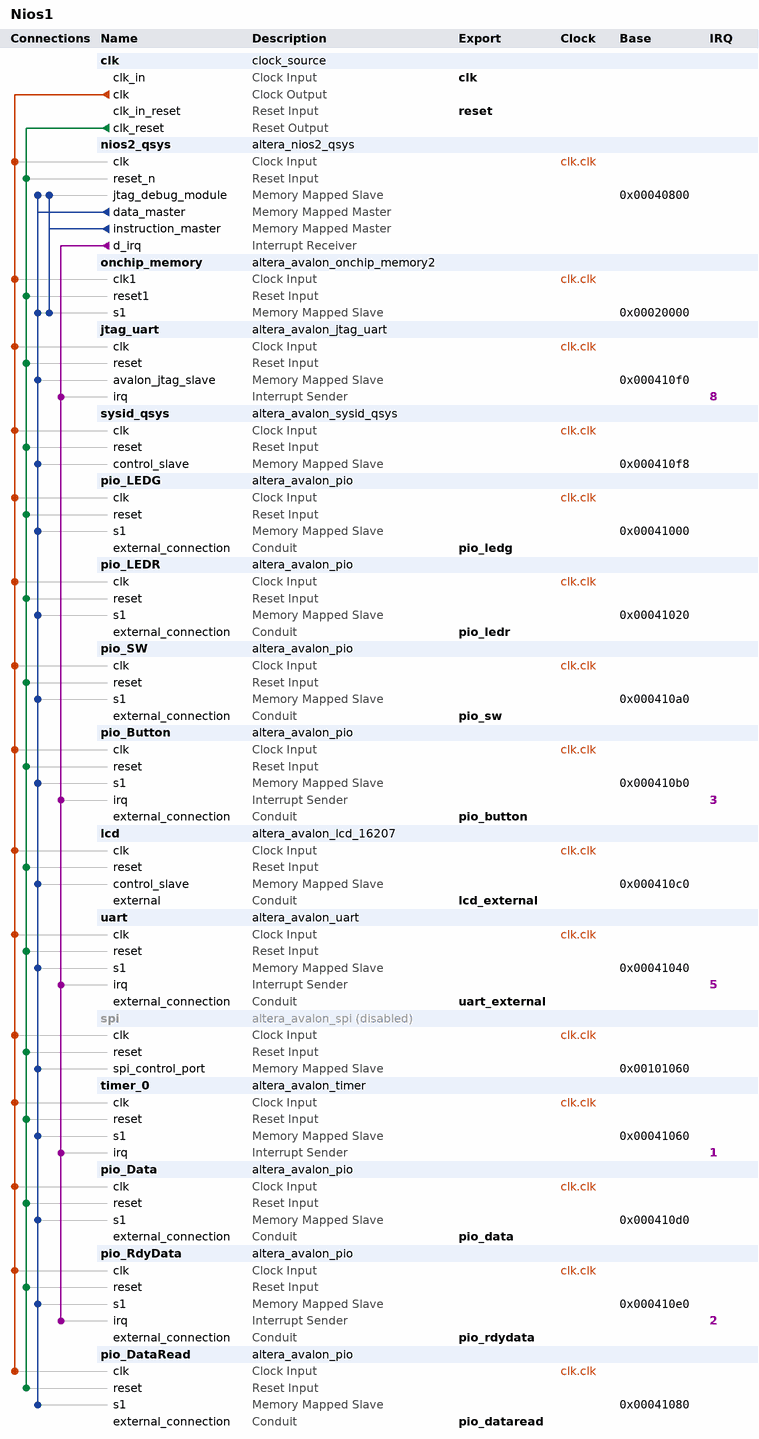
[diagram p0: system contents]
# Platform Designer (Qsys) system Nios1
# Parameters at their usual value, and those the tool derives, are not listed.
package require -exact qsys 11.1
create_system Nios1
set_project_property DEVICE_FAMILY CYCLONEIVE

add_instance clk clock_source 11.1
set_instance_parameter_value clk clockFrequency 50000000

add_instance nios2_qsys altera_nios2_qsys 11.1
set_instance_parameter_value nios2_qsys resetSlave onchip_memory.s1
set_instance_parameter_value nios2_qsys exceptionSlave onchip_memory.s1
set_instance_parameter_value nios2_qsys breakSlave nios2_qsys.jtag_debug_module
set_instance_parameter_value nios2_qsys impl Fast
set_instance_parameter_value nios2_qsys icache_size 4096

add_instance onchip_memory altera_avalon_onchip_memory2 11.1
set_instance_parameter_value onchip_memory dataWidth 32
set_instance_parameter_value onchip_memory dualPort false
set_instance_parameter_value onchip_memory initMemContent true
set_instance_parameter_value onchip_memory initializationFileName onchip_memory
set_instance_parameter_value onchip_memory memorySize 128000

add_instance jtag_uart altera_avalon_jtag_uart 11.1
set_instance_parameter_value jtag_uart simInteractiveOptions INTERACTIVE_ASCII_OUTPUT

add_instance sysid_qsys altera_avalon_sysid_qsys 11.1
set_instance_parameter_value sysid_qsys id 0

add_instance pio_LEDG altera_avalon_pio 11.1
set_instance_parameter_value pio_LEDG bitModifyingOutReg true
set_instance_parameter_value pio_LEDG direction Output
set_instance_parameter_value pio_LEDG width 8

add_instance pio_LEDR altera_avalon_pio 11.1
set_instance_parameter_value pio_LEDR bitModifyingOutReg true
set_instance_parameter_value pio_LEDR direction Output
set_instance_parameter_value pio_LEDR width 18

add_instance pio_SW altera_avalon_pio 11.1
set_instance_parameter_value pio_SW direction Input
set_instance_parameter_value pio_SW width 18

add_instance pio_Button altera_avalon_pio 11.1
set_instance_parameter_value pio_Button captureEdge true
set_instance_parameter_value pio_Button direction Input
set_instance_parameter_value pio_Button edgeType FALLING
set_instance_parameter_value pio_Button generateIRQ true
set_instance_parameter_value pio_Button irqType EDGE
set_instance_parameter_value pio_Button width 3

add_instance lcd altera_avalon_lcd_16207 11.1

add_instance uart altera_avalon_uart 11.1
set_instance_parameter_value uart baud 115200
set_instance_parameter_value uart dataBits 8
set_instance_parameter_value uart fixedBaud true
set_instance_parameter_value uart parity NONE
set_instance_parameter_value uart stopBits 1

add_instance spi altera_avalon_spi 11.1
set_instance_property spi ENABLED false
set_instance_parameter_value spi clockPolarity 0
set_instance_parameter_value spi dataWidth 8
set_instance_parameter_value spi masterSPI true
set_instance_parameter_value spi numberOfSlaves 1
set_instance_parameter_value spi targetClockRate 128000

add_instance timer_0 altera_avalon_timer 11.1
set_instance_parameter_value timer_0 period 1
set_instance_parameter_value timer_0 periodUnits MSEC
set_instance_parameter_value timer_0 timerPreset CUSTOM

add_instance pio_Data altera_avalon_pio 11.1
set_instance_parameter_value pio_Data direction Input
set_instance_parameter_value pio_Data width 12

add_instance pio_RdyData altera_avalon_pio 11.1
set_instance_parameter_value pio_RdyData captureEdge true
set_instance_parameter_value pio_RdyData direction Input
set_instance_parameter_value pio_RdyData generateIRQ true
set_instance_parameter_value pio_RdyData irqType EDGE
set_instance_parameter_value pio_RdyData width 1

add_instance pio_DataRead altera_avalon_pio 11.1
set_instance_parameter_value pio_DataRead bitModifyingOutReg true
set_instance_parameter_value pio_DataRead direction Output
set_instance_parameter_value pio_DataRead width 2

# connections
add_connection clk.clk jtag_uart.clk clock
add_connection clk.clk lcd.clk clock
add_connection clk.clk nios2_qsys.clk clock
add_connection clk.clk onchip_memory.clk1 clock
add_connection clk.clk pio_Button.clk clock
add_connection clk.clk pio_Data.clk clock
add_connection clk.clk pio_DataRead.clk clock
add_connection clk.clk pio_LEDG.clk clock
add_connection clk.clk pio_LEDR.clk clock
add_connection clk.clk pio_RdyData.clk clock
add_connection clk.clk pio_SW.clk clock
add_connection clk.clk spi.clk clock
add_connection clk.clk sysid_qsys.clk clock
add_connection clk.clk timer_0.clk clock
add_connection clk.clk uart.clk clock
add_connection clk.clk_reset jtag_uart.reset reset
add_connection clk.clk_reset lcd.reset reset
add_connection clk.clk_reset nios2_qsys.reset_n reset
add_connection clk.clk_reset onchip_memory.reset1 reset
add_connection clk.clk_reset pio_Button.reset reset
add_connection clk.clk_reset pio_Data.reset reset
add_connection clk.clk_reset pio_DataRead.reset reset
add_connection clk.clk_reset pio_LEDG.reset reset
add_connection clk.clk_reset pio_LEDR.reset reset
add_connection clk.clk_reset pio_RdyData.reset reset
add_connection clk.clk_reset pio_SW.reset reset
add_connection clk.clk_reset spi.reset reset
add_connection clk.clk_reset sysid_qsys.reset reset
add_connection clk.clk_reset timer_0.reset reset
add_connection clk.clk_reset uart.reset reset
add_connection nios2_qsys.data_master jtag_uart.avalon_jtag_slave avalon
set_connection_parameter_value nios2_qsys.data_master/jtag_uart.avalon_jtag_slave baseAddress 0x000410f0
add_connection nios2_qsys.data_master lcd.control_slave avalon
set_connection_parameter_value nios2_qsys.data_master/lcd.control_slave baseAddress 0x000410c0
add_connection nios2_qsys.data_master nios2_qsys.jtag_debug_module avalon
set_connection_parameter_value nios2_qsys.data_master/nios2_qsys.jtag_debug_module baseAddress 0x00040800
add_connection nios2_qsys.data_master onchip_memory.s1 avalon
set_connection_parameter_value nios2_qsys.data_master/onchip_memory.s1 baseAddress 0x00020000
add_connection nios2_qsys.data_master pio_Button.s1 avalon
set_connection_parameter_value nios2_qsys.data_master/pio_Button.s1 baseAddress 0x000410b0
add_connection nios2_qsys.data_master pio_Data.s1 avalon
set_connection_parameter_value nios2_qsys.data_master/pio_Data.s1 baseAddress 0x000410d0
add_connection nios2_qsys.data_master pio_DataRead.s1 avalon
set_connection_parameter_value nios2_qsys.data_master/pio_DataRead.s1 baseAddress 0x00041080
add_connection nios2_qsys.data_master pio_LEDG.s1 avalon
set_connection_parameter_value nios2_qsys.data_master/pio_LEDG.s1 baseAddress 0x00041000
add_connection nios2_qsys.data_master pio_LEDR.s1 avalon
set_connection_parameter_value nios2_qsys.data_master/pio_LEDR.s1 baseAddress 0x00041020
add_connection nios2_qsys.data_master pio_RdyData.s1 avalon
set_connection_parameter_value nios2_qsys.data_master/pio_RdyData.s1 baseAddress 0x000410e0
add_connection nios2_qsys.data_master pio_SW.s1 avalon
set_connection_parameter_value nios2_qsys.data_master/pio_SW.s1 baseAddress 0x000410a0
add_connection nios2_qsys.data_master spi.spi_control_port avalon
set_connection_parameter_value nios2_qsys.data_master/spi.spi_control_port baseAddress 0x00101060
add_connection nios2_qsys.data_master sysid_qsys.control_slave avalon
set_connection_parameter_value nios2_qsys.data_master/sysid_qsys.control_slave baseAddress 0x000410f8
add_connection nios2_qsys.data_master timer_0.s1 avalon
set_connection_parameter_value nios2_qsys.data_master/timer_0.s1 baseAddress 0x00041060
add_connection nios2_qsys.data_master uart.s1 avalon
set_connection_parameter_value nios2_qsys.data_master/uart.s1 baseAddress 0x00041040
add_connection nios2_qsys.instruction_master nios2_qsys.jtag_debug_module avalon
set_connection_parameter_value nios2_qsys.instruction_master/nios2_qsys.jtag_debug_module baseAddress 0x00040800
add_connection nios2_qsys.instruction_master onchip_memory.s1 avalon
set_connection_parameter_value nios2_qsys.instruction_master/onchip_memory.s1 baseAddress 0x00020000
add_connection nios2_qsys.d_irq jtag_uart.irq interrupt
set_connection_parameter_value nios2_qsys.d_irq/jtag_uart.irq irqNumber 8
add_connection nios2_qsys.d_irq pio_Button.irq interrupt
set_connection_parameter_value nios2_qsys.d_irq/pio_Button.irq irqNumber 3
add_connection nios2_qsys.d_irq pio_RdyData.irq interrupt
set_connection_parameter_value nios2_qsys.d_irq/pio_RdyData.irq irqNumber 2
add_connection nios2_qsys.d_irq timer_0.irq interrupt
set_connection_parameter_value nios2_qsys.d_irq/timer_0.irq irqNumber 1
add_connection nios2_qsys.d_irq uart.irq interrupt
set_connection_parameter_value nios2_qsys.d_irq/uart.irq irqNumber 5

# exported interfaces
add_interface clk clock sink
set_interface_property clk EXPORT_OF clk.clk_in
add_interface reset reset sink
set_interface_property reset EXPORT_OF clk.clk_in_reset
add_interface pio_ledg conduit end
set_interface_property pio_ledg EXPORT_OF pio_LEDG.external_connection
add_interface pio_ledr conduit end
set_interface_property pio_ledr EXPORT_OF pio_LEDR.external_connection
add_interface pio_sw conduit end
set_interface_property pio_sw EXPORT_OF pio_SW.external_connection
add_interface pio_button conduit end
set_interface_property pio_button EXPORT_OF pio_Button.external_connection
add_interface lcd_external conduit end
set_interface_property lcd_external EXPORT_OF lcd.external
add_interface uart_external conduit end
set_interface_property uart_external EXPORT_OF uart.external_connection
add_interface pio_data conduit end
set_interface_property pio_data EXPORT_OF pio_Data.external_connection
add_interface pio_rdydata conduit end
set_interface_property pio_rdydata EXPORT_OF pio_RdyData.external_connection
add_interface pio_dataread conduit end
set_interface_property pio_dataread EXPORT_OF pio_DataRead.external_connection

save_system Nios1.qsys
